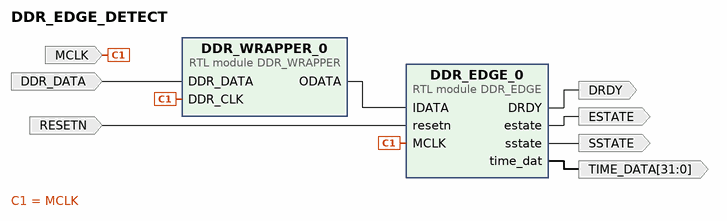
[diagram p0: block diagram of the top level]
# Vivado block design DDR_EDGE_DETECT, xc7z020clg400-1, Vivado 2019.1
create_bd_design DDR_EDGE_DETECT

create_bd_port -dir O DRDY
create_bd_port -dir O SSTATE
create_bd_port -dir O ESTATE
create_bd_port -dir O -from 31 -to 0 -type data TIME_DATA
create_bd_port -dir I -type rst RESETN
create_bd_port -dir I -type clk MCLK
set_property -dict {CONFIG.FREQ_HZ 500000000} [get_bd_ports MCLK]
create_bd_port -dir I -type data DDR_DATA

create_bd_cell -type module -reference DDR_WRAPPER DDR_WRAPPER_0
create_bd_cell -type module -reference DDR_EDGE DDR_EDGE_0

# ---- connections ----

connect_bd_net [get_bd_pins DDR_WRAPPER_0/ODATA] [get_bd_pins DDR_EDGE_0/IDATA]
connect_bd_net [get_bd_ports MCLK] [get_bd_pins DDR_WRAPPER_0/DDR_CLK] [get_bd_pins DDR_EDGE_0/MCLK]
connect_bd_net [get_bd_pins DDR_EDGE_0/DRDY] [get_bd_ports DRDY]
connect_bd_net [get_bd_pins DDR_EDGE_0/sstate] [get_bd_ports SSTATE]
connect_bd_net [get_bd_pins DDR_EDGE_0/estate] [get_bd_ports ESTATE]
connect_bd_net [get_bd_pins DDR_EDGE_0/time_dat] [get_bd_ports TIME_DATA]
connect_bd_net [get_bd_ports RESETN] [get_bd_pins DDR_EDGE_0/resetn]
connect_bd_net [get_bd_ports DDR_DATA] [get_bd_pins DDR_WRAPPER_0/DDR_DATA]

validate_bd_design
save_bd_design
